# EAGLE schematic board (EAGLE 9.2.0)
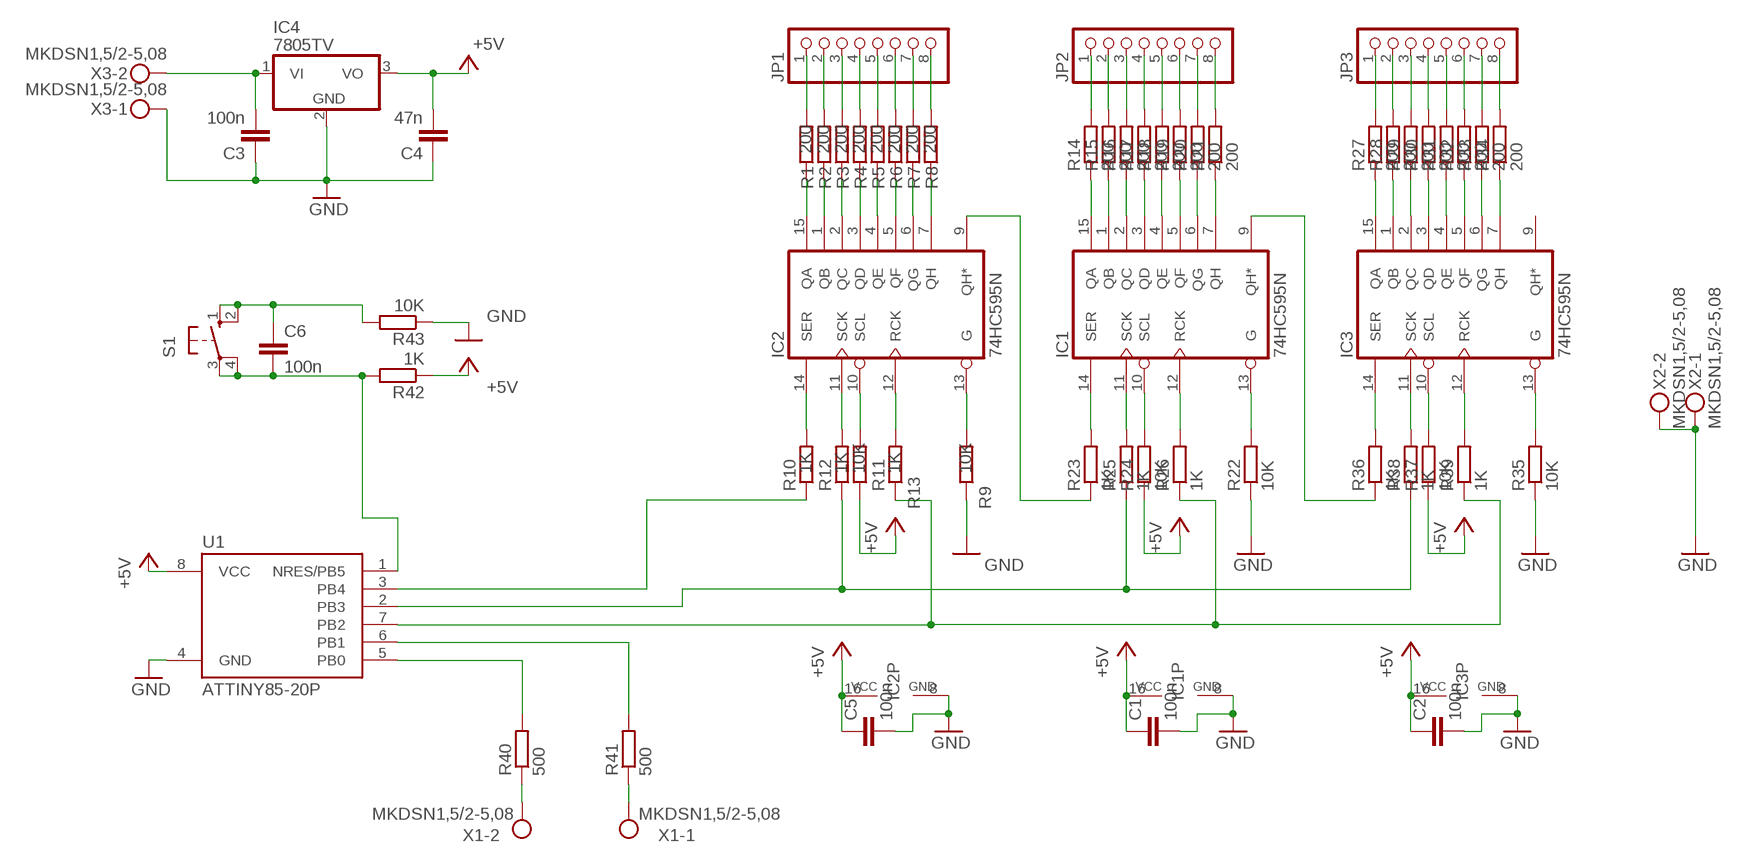
[diagram p0: schematic, sheet 1]

## Parts
C1  100n  C5/3  [C5B3]
C2  100n  C5/3  [C5B3]
C3  100n  C5/3  [C5B3]
C4  47n  C5/3  [C5B3]
C5  100n  C5/3  [C5B3]
C6  100n  C5/3  [C5B3]
IC1  74HC595N  [DIL16]
IC2  74HC595N  [DIL16]
IC3  74HC595N  [DIL16]
IC4  7805TV  [TO220V]
JP1  PINHD-1X8  [1X08]
JP2  PINHD-1X8  [1X08]
JP3  PINHD-1X8  [1X08]
R1  200  R-EU_0207/10  [0207/10]
R2  200  R-EU_0207/10  [0207/10]
R3  200  R-EU_0207/10  [0207/10]
R4  200  R-EU_0207/10  [0207/10]
R5  200  R-EU_0207/10  [0207/10]
R6  200  R-EU_0207/10  [0207/10]
R7  200  R-EU_0207/10  [0207/10]
R8  200  R-EU_0207/10  [0207/10]
R9  10K  R-EU_0207/10  [0207/10]
R10  1K  R-EU_0207/10  [0207/10]
R11  10K  R-EU_0207/10  [0207/10]
R12  1K  R-EU_0207/10  [0207/10]
R13  1K  R-EU_0207/10  [0207/10]
R14  200  R-EU_0207/10  [0207/10]
R15  200  R-EU_0207/10  [0207/10]
R16  200  R-EU_0207/10  [0207/10]
R17  200  R-EU_0207/10  [0207/10]
R18  200  R-EU_0207/10  [0207/10]
R19  200  R-EU_0207/10  [0207/10]
R20  200  R-EU_0207/10  [0207/10]
R21  200  R-EU_0207/10  [0207/10]
R22  10K  R-EU_0207/10  [0207/10]
R23  1K  R-EU_0207/10  [0207/10]
R24  10K  R-EU_0207/10  [0207/10]
R25  1K  R-EU_0207/10  [0207/10]
R26  1K  R-EU_0207/10  [0207/10]
R27  200  R-EU_0207/10  [0207/10]
R28  200  R-EU_0207/10  [0207/10]
R29  200  R-EU_0207/10  [0207/10]
R30  200  R-EU_0207/10  [0207/10]
R31  200  R-EU_0207/10  [0207/10]
R32  200  R-EU_0207/10  [0207/10]
R33  200  R-EU_0207/10  [0207/10]
R34  200  R-EU_0207/10  [0207/10]
R35  10K  R-EU_0207/10  [0207/10]
R36  1K  R-EU_0207/10  [0207/10]
R37  10K  R-EU_0207/10  [0207/10]
R38  1K  R-EU_0207/10  [0207/10]
R39  1K  R-EU_0207/10  [0207/10]
R40  500  R-EU_0207/10  [0207/10]
R41  500  R-EU_0207/10  [0207/10]
R42  1K  R-EU_0207/10  [0207/10]
R43  10K  R-EU_0207/10  [0207/10]
S1  10-XX  [B3F-10XX]
U1  ATTINY85-20P  [PDIP08_300MIL]
X1  MKDSN1,5/2-5,08  [MKDSN1,5/2-5,08]
X2  MKDSN1,5/2-5,08  [MKDSN1,5/2-5,08]
X3  MKDSN1,5/2-5,08  [MKDSN1,5/2-5,08]

## Nets
+5V: C1.1 C2.1 C4.2 C5.1 IC1.16(VCC) IC2.16(VCC) IC3.16(VCC) IC4.3(VO) R11.1 R24.1 R37.1 R42.1 U1.8(VCC)
GND: C1.2 C2.2 C3.1 C4.1 C5.2 IC1.8(GND) IC2.8(GND) IC3.8(GND) IC4.2(GND) R9.1 R22.1 R35.1 R43.1 U1.4(GND) X2.1 X2.2 X3.1
N$1: IC2.15(QA) R1.1
N$2: IC2.1(QB) R2.1
N$3: IC2.2(QC) R3.1
N$4: IC2.3(QD) R4.1
N$5: IC2.4(QE) R5.1
N$6: IC2.5(QF) R6.1
N$7: IC2.6(QG) R7.1
N$8: IC2.7(QH) R8.1
N$9: IC2.13(G) R9.2
N$10: IC2.14(SER) R10.2
N$11: IC2.11(SCK) R12.2
N$12: IC2.10(SCL) R11.2
N$13: IC2.12(RCK) R13.2
N$14: JP1.1 R1.2
N$15: JP1.2 R2.2
N$16: JP1.3 R3.2
N$17: JP1.4 R4.2
N$18: JP1.5 R5.2
N$19: JP1.6 R6.2
N$20: JP1.7 R7.2
N$21: JP1.8 R8.2
N$22: IC1.15(QA) R14.1
N$23: IC1.1(QB) R15.1
N$24: IC1.2(QC) R16.1
N$25: IC1.3(QD) R17.1
N$26: IC1.4(QE) R18.1
N$27: IC1.5(QF) R19.1
N$28: IC1.6(QG) R20.1
N$29: IC1.7(QH) R21.1
N$30: IC1.13(G) R22.2
N$31: IC1.14(SER) R23.2
N$32: IC1.11(SCK) R25.2
N$33: IC1.10(SCL) R24.2
N$34: IC1.12(RCK) R26.2
N$35: JP2.1 R14.2
N$36: JP2.2 R15.2
N$37: JP2.3 R16.2
N$38: JP2.4 R17.2
N$39: JP2.5 R18.2
N$40: JP2.6 R19.2
N$41: JP2.7 R20.2
N$42: JP2.8 R21.2
N$43: IC3.15(QA) R27.1
N$44: IC3.1(QB) R28.1
N$45: IC3.2(QC) R29.1
N$46: IC3.3(QD) R30.1
N$47: IC3.4(QE) R31.1
N$48: IC3.5(QF) R32.1
N$49: IC3.6(QG) R33.1
N$50: IC3.7(QH) R34.1
N$51: IC3.13(G) R35.2
N$52: IC3.14(SER) R36.2
N$53: IC3.11(SCK) R38.2
N$54: IC3.10(SCL) R37.2
N$55: IC3.12(RCK) R39.2
N$56: JP3.1 R27.2
N$57: JP3.2 R28.2
N$58: JP3.3 R29.2
N$59: JP3.4 R30.2
N$60: JP3.5 R31.2
N$61: JP3.6 R32.2
N$62: JP3.7 R33.2
N$63: JP3.8 R34.2
N$64: IC2.9(QH*) R23.1
N$65: IC1.9(QH*) R36.1
N$66: R40.1 X1.2
N$67: R12.1 R25.1 R38.1 U1.2(PB3)
N$68: R13.1 R26.1 R39.1 U1.7(PB2)
N$69: R40.2 U1.5(PB0)
N$70: R41.2 U1.6(PB1)
N$71: R41.1 X1.1
N$72: C3.2 IC4.1(VI) X3.2
N$73: R10.1 U1.3(PB4)
N$74: C6.1 R43.2 S1.1(S) S1.2(S1)
N$75: C6.2 R42.2 S1.3(P) S1.4(P1) U1.1(NRES/PB5)
Unconnected: IC3.9(QH*)

## Library data of the parts
C1-C6 = capacitor-wima:C: CAPACITOR naming: grid - package width
IC1-IC3 = 74xx-eu:74*595: 8-bit SHIFT REGISTER, output latch
IC4 = linear:78*: Positive VOLTAGE REGULATOR Source: http://cache.national.com/ds/LM/LM78L05.pdf http://www.fairchildsemi.com/ds/LM/LM7805.pdf
JP1-JP3 = Connector:PINHD-1X8: PIN HEADER; CATEGORY: CONNECTOR; SUB-CATEGORY: PIN-HEADER
R1-R43 = resistor:R-EU_: RESISTOR, European symbol
S1 = switch-omron:10-XX: OMRON SWITCH; MPN: B3F-1000; OC_FARNELL: 176432; OC_NEWARK: 36M3542
U1 = attiny25_45_85:ATTINY85*: ATMEL ATtiny 85 Packages: P = PDIP 08 30mil S = SOIC 08 EIAJ 208mil Technologies Note: for complete ordering code (temp. range, finish, tape&reel etc.) see www.atmel.com • Supply Voltage: V = (1.8…5.5)V | [blank] = (2.7…5.5)V • Speed: 10 = 10 MHz | 20 = 20 MHz Author: Dipl.-Ing. FH Rainer Bayer HHN Hochschule Heilbronn (Heilbronn University), rainer.bayer@hs-heilbronn.de Ingenieurbüro ing-rb, mail@ing-rb.de
X1-X3 = con-phoenix-508:MKDSN1,5/2-5,08: MKDSN 1,5/ 2-5,08 Printklemme Nennstrom: 13,5 A Nennspannung: 250 V Rastermaß: 5,08 mm Polzahl: 2 Anschlussart: Schraubanschluss Montage: Löten Anschlussrichtung Leiter/Platine: 0 ° Artikelnummer: 1729128 Source: http://eshop.phoenixcontact.com .. 1729128.pdf